# Altium schematic sheet Sheet2.SchDoc
size A4
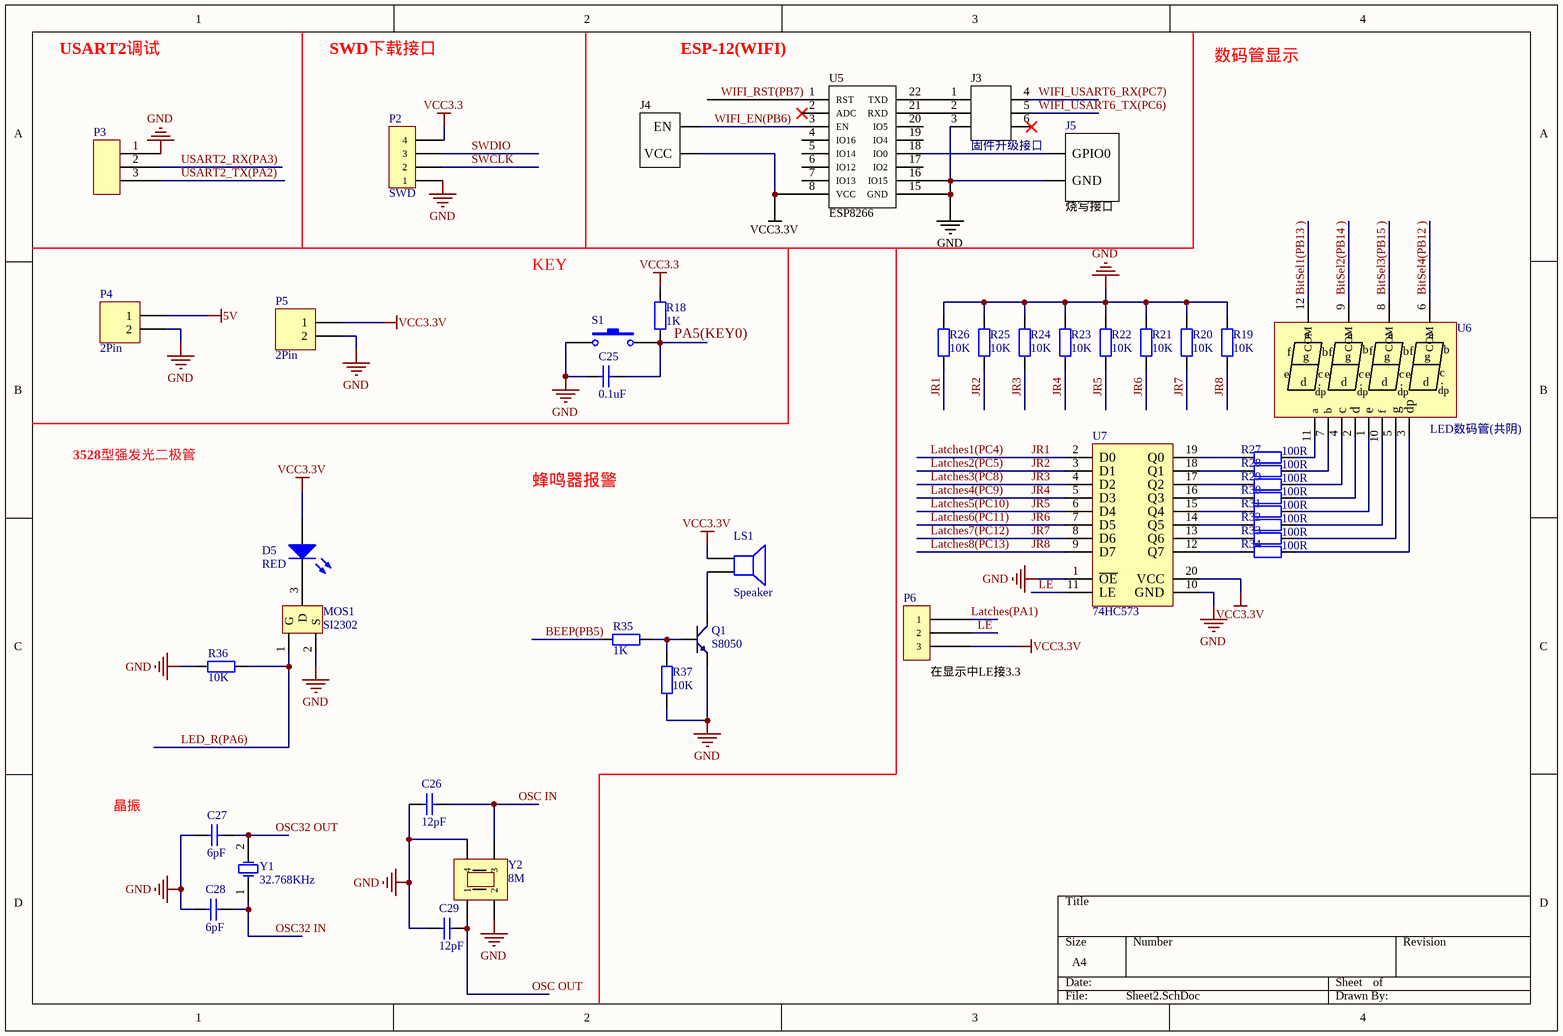
[diagram p0: Sheet2.SchDoc]

## Parts
C25  0.1uF  [LC-0603_C(普通电容)]
C26  值: 12pF  [LC-0603_C(普通电容)]  (hidden comment: 22pF)
C27  6pF  [LC-0603_C(普通电容)]
C28  6pF  [LC-0603_C(普通电容)]
C29  值: 12pF  [LC-0603_C(普通电容)]  (hidden comment: 22pF)
D5  RED  [发光二极管(CASE-B_3528国星光电)]
J3  固件升级接口  [Header2*3 2.54mm]
J4  烧录接口  [Header1*2 2.54mm]  (value not drawn)
J5  烧写接口  [Header1*2 2.54mm]
LS1  Speaker  [BEEP]
MOS1  SI2302  [MOS(SOP-23美微科)]
P2  SWD  [Header1*4 2.54MM]
P3  串口2调试  [Header1*3 2.54mm]  (value not drawn)
P4  2Pin  [Header1*2 2.54mm]
P5  2Pin  [Header1*2 2.54mm]
P6  3P供电选择  [Header1*3 2.54mm]  (value not drawn)
Q1  S8050  [SOP-23(NPN江苏长电)]
R18  1K  [LC-0603_R(电阻)]
R19  10k  [LC-0603_R(电阻)]
R20  10k  [LC-0603_R(电阻)]
R21  10k  [LC-0603_R(电阻)]
R22  10k  [LC-0603_R(电阻)]
R23  10k  [LC-0603_R(电阻)]
R24  10k  [LC-0603_R(电阻)]
R25  10k  [LC-0603_R(电阻)]
R26  10k  [LC-0603_R(电阻)]
R27  value 100R  [LC-0603_R(电阻)]  (hidden comment: 10k)
R28  value 100R  [LC-0603_R(电阻)]  (hidden comment: 10k)
R29  value 100R  [LC-0603_R(电阻)]  (hidden comment: 10k)
R30  value 100R  [LC-0603_R(电阻)]  (hidden comment: 10k)
R31  value 100R  [LC-0603_R(电阻)]  (hidden comment: 10k)
R32  value 100R  [LC-0603_R(电阻)]  (hidden comment: 10k)
R33  value 100R  [LC-0603_R(电阻)]  (hidden comment: 10k)
R34  value 100R  [LC-0603_R(电阻)]  (hidden comment: 10k)
R35  value 1K  [LC-0603_R(电阻)]  (hidden comment: 10k)
R36  10k  [LC-0603_R(电阻)]
R37  10k  [LC-0603_R(电阻)]
S1  SW-PB  [key-4p]  (value not drawn)
U5  ESP8266  [ESP8266]
U6  LED数码管(共阴)  [4位共阴数码管(0.36mm 30*14)]
U7  74HC573  [SOIC-20_300mil(74HC573)]
Y1  32.768KHz  [NX3215晶振]
Y2  8M  [SMD3225(8M晶振)]

## Nets
5V: P4.1
GND: C25.2 C26.2 C27.2 C28.2 C29.2 J3.3(GND) J5.2(GND) MOS1.2(S) P2.1 P3.1(GND) P4.2 P5.2 Q1.2(E) R19.1 R20.1 R21.1 R22.1 R23.1 R24.1 R25.1 R26.1 R36.2 R37.2 S1.1 U5.15(GND) U5.16(IO15) U7.1(~{OE}) U7.10(GND) Y2.2 Y2.4
VCC3.3: P2.4 R18.2
VCC3.3V: D5.1(A) J4.1(VCC) LS1.1 P5.1 P6.3 U5.8(VCC) U7.20(VCC)
BEEP(PB5): R35.2
BitSel1(PB13 ): U6.12(COM)
BitSel2(PB14 ): U6.9(COM)
BitSel3(PB15 ): U6.8(COM)
BitSel4(PB12 ): U6.6(COM)
JR1: R26.2 U7.2(D0)  [also labelled Latches1(PC4)]
JR2: R25.2 U7.3(D1)  [also labelled Latches2(PC5)]
JR3: R24.2 U7.4(D2)  [also labelled Latches3(PC8)]
JR4: R23.2 U7.5(D3)  [also labelled Latches4(PC9)]
JR5: R22.2 U7.6(D4)  [also labelled Latches5(PC10)]
JR6: R21.2 U7.7(D5)  [also labelled Latches6(PC11)]
JR7: R20.2 U7.8(D6)  [also labelled Latches7(PC12)]
JR8: R19.2 U7.9(D7)  [also labelled Latches8(PC13)]
Latches(PA1): P6.1
LE: P6.2 U7.11(LE)
LED_R(PA6): MOS1.1(G) R36.1
OSC32 IN: C28.1 Y1.1(OSC1)
OSC32 OUT: C27.1 Y1.2(OSC2)
OSC IN: C26.1 Y2.3
OSC OUT: C29.1 Y2.1
PA5(KEY0): C25.1 R18.1 S1.2
SWCLK: P2.2
SWDIO: P2.3
USART2_RX(PA3): P3.2(PA10(USART1_RX))
USART2_TX(PA2): P3.3(PA9(USART1_TX))
WIFI_EN(PB6): J4.2(EN) U5.3(EN)
WIFI_RST(PB7): U5.1(RST)
WIFI_USART6_RX(PC7): J3.4(RXD)
WIFI_USART6_TX(PC6): J3.5(TXD)
NetD5_2: D5.2(K) MOS1.3(D)
NetJ3_1: J3.1(TXD) U5.22(TXD)
NetJ3_2: J3.2(RXD) U5.21(RXD)
NetJ5_1: J5.1(GPIO0) U5.18(IO0)
NetLS1_2: LS1.2 Q1.3(C)
NetQ1_1: Q1.1(B) R35.1 R37.1
NetR27_1: R27.1 U6.11(a)
NetR27_2: R27.2 U7.19(Q0)
NetR28_1: R28.1 U6.7(b)
NetR28_2: R28.2 U7.18(Q1)
NetR29_1: R29.1 U6.4(c)
NetR29_2: R29.2 U7.17(Q2)
NetR30_1: R30.1 U6.2(d)
NetR30_2: R30.2 U7.16(Q3)
NetR31_1: R31.1 U6.1(e)
NetR31_2: R31.2 U7.15(Q4)
NetR32_1: R32.1 U6.10(f)
NetR32_2: R32.2 U7.14(Q5)
NetR33_1: R33.1 U6.5(g)
NetR33_2: R33.2 U7.13(Q6)
NetR34_1: R34.1 U6.3(dp)
NetR34_2: R34.2 U7.12(Q7)

Not connected (* = marked no-connect by the designer): J3 6(GND)*; U5 2(ADC)* 4(IO16) 5(IO14) 6(IO12) 7(IO13) 17(IO2) 19(IO4) 20(IO5)

## Notes on the sheet
- USART2调试
- SWD下载接口
- ESP-12(WIFI)
- 数码管显示
- KEY
- 3528型强发光二极管
- 蜂鸣器报警
- (near P6) 在显示中LE接3.3
- 晶振
- (in symbol 4位8段数码管) .

## Library data of the parts
C25 = Cap Semi: 贴片电容; Published: 8-Jun-2000; LatestRevisionDate: 29-May-2009; LatestRevisionNote: IPC-7351 Footprint Added.; PackageReference: C1206; Publisher: Altium Limited; PackageDescription: Chip Capacitor; Value: 0.1uF
C26 = Cap Semi: 贴片电阻; 名称: 电容; Published: 8-Jun-2000; LatestRevisionDate: 29-May-2009; LatestRevisionNote: IPC-7351 Footprint Added.; PackageReference: C1206; Publisher: Altium Limited; PackageDescription: Chip Capacitor
C27 = Cap Semi: 贴片电阻; Published: 8-Jun-2000; LatestRevisionDate: 29-May-2009; LatestRevisionNote: IPC-7351 Footprint Added.; PackageReference: C1206; Publisher: Altium Limited; PackageDescription: Chip Capacitor; Value: 6pF
C28 = Cap Semi: 贴片电阻; 名称: 电阻; Published: 8-Jun-2000; LatestRevisionDate: 29-May-2009; LatestRevisionNote: IPC-7351 Footprint Added.; PackageReference: C1206; Publisher: Altium Limited; PackageDescription: Chip Capacitor; 值: 6pF
C29 = Cap Semi: 贴片电容; 名称: 电容; Published: 8-Jun-2000; LatestRevisionDate: 29-May-2009; LatestRevisionNote: IPC-7351 Footprint Added.; PackageReference: C1206; Publisher: Altium Limited; PackageDescription: Chip Capacitor
D5 = LED2: 发光二极管; 封装: CASE-B_3528; 规格: 红色 贴片LED (280-350mcd) 编带; 名称: 发光二极管; 立创商城编号: C85318
J3 = Header2*3: 固件升级接口2.54mm
J4 = ESP烧录: 烧录接口2.54mm
J5 = Header1*2 2.54mm: 烧写接口2.54mm
LS1 = Speaker: Loudspeaker; 名称: 蜂鸣器; 封装: RB5-9
MOS1 = MOS-N: AP2306; 名称: MOS(场效应管)(美微科); 封装: SOT-23(SOT-23-3); 规格: SI2302-TP 编带; 立创商城编号: C77977
P2 = JMP2: 杜邦线2.54
P3 P6 = SIP: 排针 2.54MM
P4 P5 = Header 2: Header, 2-Pin; 名称: 单排排针; 规格: 2.54mmX0.55mm; 封装: HDR1X2
Q1 = S8050: NPN; 名称: 三极管(S8050)长苏长电; 封装: SOT-23(SOT-23-3); 规格: L档120-200 编带; 立创商城编号: C105433
R18-R37 = Res2: 贴片电阻; Published: 8-Jun-2000; LatestRevisionDate: 17-Jul-2002; LatestRevisionNote: Re-released for DXP Platform.; PackageReference: AXIAL-0.4; Publisher: Altium Limited; PackageDescription: Axial Device, Thru-Hole; 2 Leads; 0.4 in Pin Spacing
  R18: Value: 1K
  R19-R26 R36 R37: Value: 10K
S1 = SW-PB: 轻触开关 3*6*2.5mm 白头; Published: 24-Mar-1999; LatestRevisionDate: 17-Jul-2002; LatestRevisionNote: Re-released for DXP Platform.; PackageReference: SPST-2; Publisher: Altium Limited; PackageDescription: Switch; 2 Leads
U5 = ESP8266: ESP-12F; 立创商城编号: C82891
U6 = 4位8段数码管: 共阴数码管; 名称: LED数码管(国产); 封装: 直插; 规格: 四位0.36英寸红色共阴数码管 袋装; 立创商城编号: C10708
U7 = 74HC573: 锁存器; 名称: 74系列逻辑芯片(安世); 封装: SOIC-20_300mil; 规格: 74HC573D,653 编带; 立创商城编号: C5608
Y1 = XTAL: FC135 32.768K 12.5PF 20ppm; 名称: 贴片无源晶振(NDK); 封装: SMD-3215_2P; 规格: 32.768KHZ 6pF 编带; 立创商城编号: C156244
Y2 = XTAL: 25M 20PF 10PPM; 名称: 贴片无源晶振(KDS); 封装: SMD-3225_4P; 规格: 8MHz 12pF 20ppm 编带; 立创商城编号: C57131